# Altium schematic sheet hdmi.SchDoc: Example Template
size A4; CompanyName: University of Manchester; Engineer: Sam Walsh; Organization: University of Manchester; Address1: L3, 12a Rodborough Rd; Address2: Frenchs Forest; Address3: NSW; Address4: Australia 2086; DocumentNumber: 1; Revision: 0; SheetNumber: 3; SheetTotal: 8; Scale: Ratio
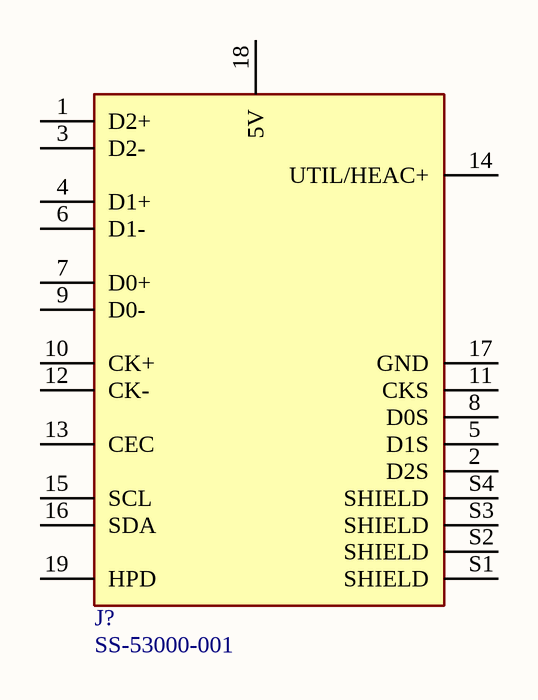
[diagram p0: hdmi.SchDoc]

## Parts
J?  SS-53000-001  [STEWART_SS-53000-001]

## Nets

Not connected (* = marked no-connect by the designer): J? 1(D2+) 2(D2S) 3(D2-) 4(D1+) 5(D1S) 6(D1-) 7(D0+) 8(D0S) 9(D0-) 10(CK+) 11(CKS) 12(CK-) 13(CEC) 14(UTIL/HEAC+) 15(SCL) 16(SDA) 17(GND) 18(5V) 19(HPD) S1(SHIELD) S2(SHIELD) S3(SHIELD) S4(SHIELD)

## Notes on the sheet
- Size:
- Title
- A4
- Scale:
- NTS
- Revision:
- Designer
- Date:
- Sheet
- of

## Library data of the parts
J? = SS-53000-001: HDMI Connector | Right Angle | Without Flange | -20C to 85C; Price: None; Value: *; Package: None; Availability: Unavailable; MP: SS-53000-001